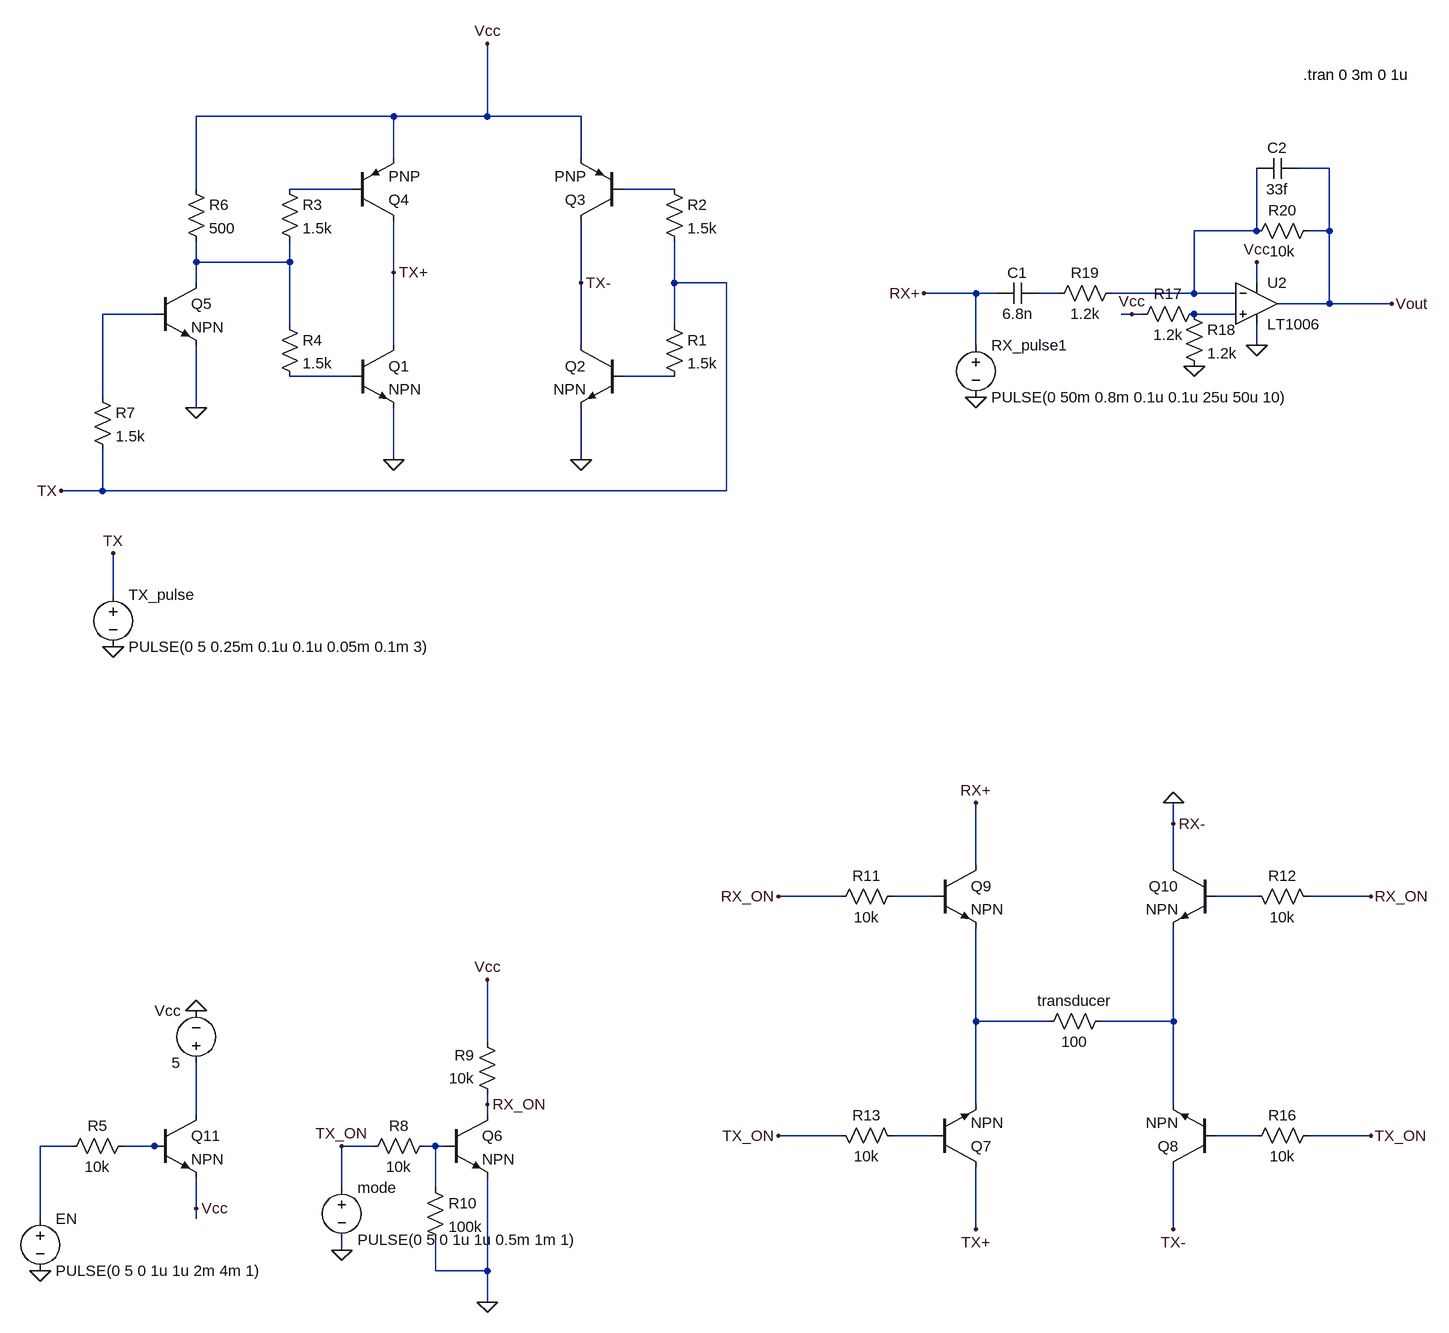
[diagram p0: schematic sonar.asc]
sonar.asc, the LTspice schematic file:
Version 4
SHEET 1 1588 1120
WIRE -1552 -752 -1856 -752
WIRE -1408 -752 -1408 -864
WIRE -1408 -752 -1552 -752
WIRE -1264 -752 -1408 -752
WIRE -1552 -688 -1552 -752
WIRE -1264 -688 -1264 -752
WIRE -112 -672 -160 -672
WIRE -1856 -640 -1856 -752
WIRE -1616 -640 -1712 -640
WIRE -1120 -640 -1200 -640
WIRE -224 -576 -224 -672
WIRE -224 -576 -320 -576
WIRE -112 -576 -112 -672
WIRE -112 -576 -144 -576
WIRE -1856 -528 -1856 -560
WIRE -1712 -528 -1712 -560
WIRE -1712 -528 -1856 -528
WIRE -1552 -512 -1552 -592
WIRE -1856 -496 -1856 -528
WIRE -1264 -496 -1264 -592
WIRE -1120 -496 -1120 -560
WIRE -1040 -496 -1120 -496
WIRE -224 -496 -224 -528
WIRE -656 -480 -736 -480
WIRE -624 -480 -656 -480
WIRE -528 -480 -560 -480
WIRE -320 -480 -320 -576
WIRE -320 -480 -448 -480
WIRE -256 -480 -320 -480
WIRE -112 -464 -112 -576
WIRE -112 -464 -192 -464
WIRE -16 -464 -112 -464
WIRE -1920 -448 -2000 -448
WIRE -416 -448 -432 -448
WIRE -400 -448 -416 -448
WIRE -256 -448 -320 -448
WIRE -1712 -432 -1712 -528
WIRE -1120 -432 -1120 -496
WIRE -1552 -400 -1552 -512
WIRE -1264 -400 -1264 -496
WIRE -656 -400 -656 -480
WIRE -224 -400 -224 -432
WIRE -1616 -352 -1712 -352
WIRE -1120 -352 -1200 -352
WIRE -2000 -320 -2000 -448
WIRE -1856 -304 -1856 -400
WIRE -1552 -224 -1552 -304
WIRE -1264 -224 -1264 -304
WIRE -2000 -176 -2000 -240
WIRE -2000 -176 -2064 -176
WIRE -1040 -176 -1040 -496
WIRE -1040 -176 -2000 -176
WIRE -1984 -16 -1984 -80
WIRE -352 336 -352 304
WIRE -656 400 -656 304
WIRE -352 400 -352 336
WIRE -864 448 -960 448
WIRE -720 448 -784 448
WIRE -224 448 -288 448
WIRE -48 448 -144 448
WIRE -656 640 -656 496
WIRE -544 640 -656 640
WIRE -352 640 -352 496
WIRE -352 640 -464 640
WIRE -1408 672 -1408 576
WIRE -1408 768 -1408 752
WIRE -656 768 -656 640
WIRE -352 768 -352 640
WIRE -1856 784 -1856 704
WIRE -1408 784 -1408 768
WIRE -864 816 -960 816
WIRE -720 816 -784 816
WIRE -224 816 -288 816
WIRE -48 816 -144 816
WIRE -2048 832 -2096 832
WIRE -1920 832 -1968 832
WIRE -1904 832 -1920 832
WIRE -1584 832 -1632 832
WIRE -1488 832 -1504 832
WIRE -1472 832 -1488 832
WIRE -1632 896 -1632 832
WIRE -1488 896 -1488 832
WIRE -1856 928 -1856 880
WIRE -2096 944 -2096 832
WIRE -1856 944 -1856 928
WIRE -656 960 -656 864
WIRE -352 960 -352 864
WIRE -1632 992 -1632 976
WIRE -1488 1024 -1488 976
WIRE -1408 1024 -1408 880
WIRE -1408 1024 -1488 1024
WIRE -1408 1072 -1408 1024
FLAG -1264 -224 0
FLAG -1552 -224 0
FLAG -1856 -304 0
FLAG -1984 64 0
FLAG -1408 -864 Vcc
FLAG -1984 -80 TX
FLAG -1632 992 0
FLAG -1632 832 TX_ON
FLAG -1408 576 Vcc
FLAG -1408 1072 0
FLAG -1408 768 RX_ON
FLAG -960 816 TX_ON
FLAG -48 816 TX_ON
FLAG -1552 -512 TX+
FLAG -1264 -496 TX-
FLAG -656 960 TX+
FLAG -352 960 TX-
FLAG -960 448 RX_ON
FLAG -48 448 RX_ON
FLAG -656 304 RX+
FLAG -352 304 0
FLAG -352 336 RX-
FLAG -2096 1024 0
FLAG -2064 -176 TX
FLAG -1856 624 0
FLAG -1856 928 Vcc
FLAG -320 -368 0
FLAG -16 -464 Vout
FLAG -224 -528 Vcc
FLAG -224 -400 0
FLAG -416 -448 Vcc
FLAG -656 -320 0
FLAG -736 -480 RX+
SYMBOL npn -1616 -400 R0
SYMATTR InstName Q1
SYMBOL npn -1200 -400 M0
SYMATTR InstName Q2
SYMBOL pnp -1200 -592 R180
SYMATTR InstName Q3
SYMBOL pnp -1616 -592 M180
SYMATTR InstName Q4
SYMBOL res -1136 -448 R0
SYMATTR InstName R1
SYMATTR Value 1.5k
SYMBOL res -1136 -656 R0
SYMATTR InstName R2
SYMATTR Value 1.5k
SYMBOL res -1728 -656 R0
SYMATTR InstName R3
SYMATTR Value 1.5k
SYMBOL res -1728 -448 R0
SYMATTR InstName R4
SYMATTR Value 1.5k
SYMBOL res -448 624 R90
WINDOW 0 0 56 VBottom 2
WINDOW 3 32 56 VTop 2
SYMATTR InstName transducer
SYMATTR Value 100
SYMBOL res -1872 -656 R0
SYMATTR InstName R6
SYMATTR Value 500
SYMBOL npn -1920 -496 R0
SYMATTR InstName Q5
SYMBOL res -2016 -336 R0
SYMATTR InstName R7
SYMATTR Value 1.5k
SYMBOL voltage -1984 -32 R0
SYMATTR InstName TX_pulse
SYMATTR Value PULSE(0 5 0.25m 0.1u 0.1u 0.05m 0.1m 3)
SYMBOL npn -1472 784 R0
SYMATTR InstName Q6
SYMBOL res -1488 816 R90
WINDOW 0 0 56 VBottom 2
WINDOW 3 32 56 VTop 2
SYMATTR InstName R8
SYMATTR Value 10k
SYMBOL res -1392 768 R180
WINDOW 0 36 76 Left 2
WINDOW 3 36 40 Left 2
SYMATTR InstName R9
SYMATTR Value 10k
SYMBOL voltage -1632 880 R0
SYMATTR InstName mode
SYMATTR Value PULSE(0 5 0 1u 1u 0.5m 1m 1)
SYMBOL res -1504 880 R0
SYMATTR InstName R10
SYMATTR Value 100k
SYMBOL npn -720 864 M180
SYMATTR InstName Q7
SYMBOL res -768 832 M270
WINDOW 0 32 56 VTop 2
WINDOW 3 0 56 VBottom 2
SYMATTR InstName R13
SYMATTR Value 10k
SYMBOL npn -288 864 R180
SYMATTR InstName Q8
SYMBOL res -240 832 R270
WINDOW 0 32 56 VTop 2
WINDOW 3 0 56 VBottom 2
SYMATTR InstName R16
SYMATTR Value 10k
SYMBOL npn -720 400 R0
SYMATTR InstName Q9
SYMBOL res -768 432 R90
WINDOW 0 0 56 VBottom 2
WINDOW 3 32 56 VTop 2
SYMATTR InstName R11
SYMATTR Value 10k
SYMBOL npn -288 400 M0
SYMATTR InstName Q10
SYMBOL res -240 432 M90
WINDOW 0 0 56 VBottom 2
WINDOW 3 32 56 VTop 2
SYMATTR InstName R12
SYMATTR Value 10k
SYMBOL npn -1920 784 R0
SYMATTR InstName Q11
SYMBOL voltage -2096 928 R0
SYMATTR InstName EN
SYMATTR Value PULSE(0 5 0 1u 1u 2m 4m 1)
SYMBOL res -1952 816 R90
WINDOW 0 0 56 VBottom 2
WINDOW 3 32 56 VTop 2
SYMATTR InstName R5
SYMATTR Value 10k
SYMBOL voltage -1856 720 R180
WINDOW 0 24 96 Left 2
WINDOW 3 24 16 Left 2
SYMATTR InstName Vcc
SYMATTR Value 5
SYMBOL LT1006 -224 -528 R0
SYMATTR InstName U2
SYMBOL res -304 -464 R90
WINDOW 0 0 56 VBottom 2
WINDOW 3 32 56 VTop 2
SYMATTR InstName R17
SYMATTR Value 1.2k
SYMBOL res -336 -464 R0
SYMATTR InstName R18
SYMATTR Value 1.2k
SYMBOL res -432 -496 R90
WINDOW 0 0 56 VBottom 2
WINDOW 3 32 56 VTop 2
SYMATTR InstName R19
SYMATTR Value 1.2k
SYMBOL res -128 -592 R90
WINDOW 0 0 56 VBottom 2
WINDOW 3 32 56 VTop 2
SYMATTR InstName R20
SYMATTR Value 10k
SYMBOL cap -560 -496 R90
WINDOW 0 0 32 VBottom 2
WINDOW 3 32 32 VTop 2
SYMATTR InstName C1
SYMATTR Value 6.8n
SYMBOL cap -160 -688 R90
WINDOW 0 0 32 VBottom 2
WINDOW 3 32 32 VTop 2
SYMATTR InstName C2
SYMATTR Value 33f
SYMBOL voltage -656 -416 R0
SYMATTR InstName RX_pulse1
SYMATTR Value PULSE(0 50m 0.8m 0.1u 0.1u 25u 50u 10)
TEXT -152 -816 Left 2 !.tran 0 3m 0 1u

The netlist it stands for:
* sonar.asc
Q1 TX+ N008 0 0 NPN
Q2 TX- N009 0 0 NPN
Q3 TX- N002 Vcc 0 PNP
Q4 TX+ N001 Vcc 0 PNP
R1 TX N009 1.5k
R2 N002 TX 1.5k
R3 N001 N004 1.5k
R4 N004 N008 1.5k
R§transducer N013 N012 100
R6 Vcc N004 500
Q5 N004 N006 0 0 NPN
R7 N006 TX 1.5k
V§TX_pulse TX 0 PULSE(0 5 0.25m 0.1u 0.1u 0.05m 0.1m 3)
Q6 RX_ON N019 0 0 NPN
R8 N019 TX_ON 10k
R9 RX_ON Vcc 10k
V§mode TX_ON 0 PULSE(0 5 0 1u 1u 0.5m 1m 1)
R10 N019 0 100k
Q7 TX+ N015 N012 0 NPN
R13 N015 TX_ON 10k
Q8 TX- N016 N013 0 NPN
R16 N016 TX_ON 10k
Q9 RX+ N010 N012 0 NPN
R11 N010 RX_ON 10k
Q10 0 N011 N013 0 NPN
R12 N011 RX_ON 10k
Q11 N014 N018 Vcc 0 NPN
V§EN N017 0 PULSE(0 5 0 1u 1u 2m 4m 1)
R5 N018 N017 10k
Vcc N014 0 5
XU2 N007 N003 Vcc 0 Vout LT1006  ; pins In+ In- V+ V- OUT
R17 N007 Vcc 1.2k
R18 N007 0 1.2k
R19 N003 N005 1.2k
R20 Vout N003 10k
C1 N005 RX+ 6.8n
C2 Vout N003 33f
V§RX_pulse1 RX+ 0 PULSE(0 50m 0.8m 0.1u 0.1u 25u 50u 10)
.model NPN NPN
.model PNP PNP
.lib standard.bjt
.tran 0 3m 0 1u
.lib LTC.lib
.backanno
.end